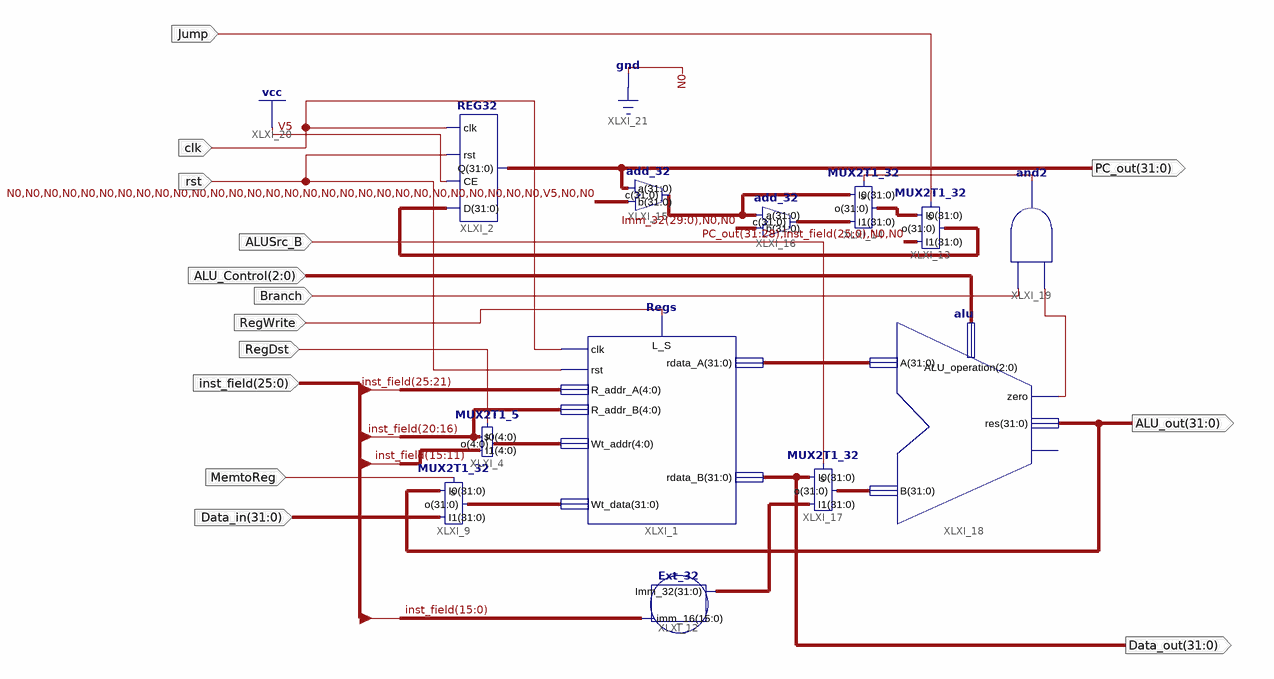
[diagram p0: schematic sheet 1]
// Xilinx ISE schematic Data_path.sch (kintex7) as structural Verilog: 12 symbols, 14 ports
module Data_path (
  input  RegDst,
  input  MemtoReg,
  input  [31:0] Data_in,
  input  [25:0] inst_field,
  input  [2:0] ALU_Control,
  input  clk,
  input  rst,
  input  RegWrite,
  input  Branch,
  input  ALUSrc_B,
  input  Jump,
  output [31:0] Data_out,
  output [31:0] PC_out,
  output [31:0] ALU_out
);

  wire XLXN_82, XLXN_87;
  wire [4:0] XLXN_1;
  wire [31:0] Imm_32, pc_4, XLXN_4, XLXN_37, XLXN_38, XLXN_73, XLXN_79, XLXN_80;

  Regs XLXI_1 (
    .clk(clk), .L_S(RegWrite), .rdata_A(XLXN_38), .rst(rst), .Wt_data(XLXN_4), .rdata_B(Data_out),
    .R_addr_A(inst_field[25:21]), .R_addr_B(inst_field[20:16]), .Wt_addr(XLXN_1));
  MUX2T1_32 XLXI_9 (.s(MemtoReg), .I0(ALU_out), .I1(Data_in), .o(XLXN_4));
  Ext_32 XLXI_12 (.imm_16(inst_field[15:0]), .Imm_32(Imm_32));
  add_32 XLXI_15 (.c(pc_4), .a(PC_out), .b(32'b00000000000000000000000000000100));
  MUX2T1_5 XLXI_4 (.I1(inst_field[15:11]), .I0(inst_field[20:16]), .o(XLXN_1), .s(RegDst));
  alu XLXI_18 (.zero(XLXN_82), .res(ALU_out), .A(XLXN_38), .B(XLXN_37), .ALU_operation(ALU_Control));  // open: overflow
  MUX2T1_32 XLXI_17 (.s(ALUSrc_B), .I0(Data_out), .I1(Imm_32), .o(XLXN_37));
  add_32 XLXI_16 (.c(XLXN_73), .a(pc_4), .b({Imm_32[29:0], 2'b00}));
  REG32 XLXI_2 (.D(XLXN_79), .CE(1'b1), .rst(rst), .clk(clk), .Q(PC_out));
  MUX2T1_32 XLXI_14 (.s(XLXN_87), .I0(pc_4), .I1(XLXN_73), .o(XLXN_80));
  MUX2T1_32 XLXI_13 (.s(Jump), .I0(XLXN_80), .I1({PC_out[31:28], inst_field, 2'b00}), .o(XLXN_79));
  and XLXI_19 (XLXN_87, XLXN_82, Branch);
endmodule
